# Altium project PCB_Project_1.PrjPcb
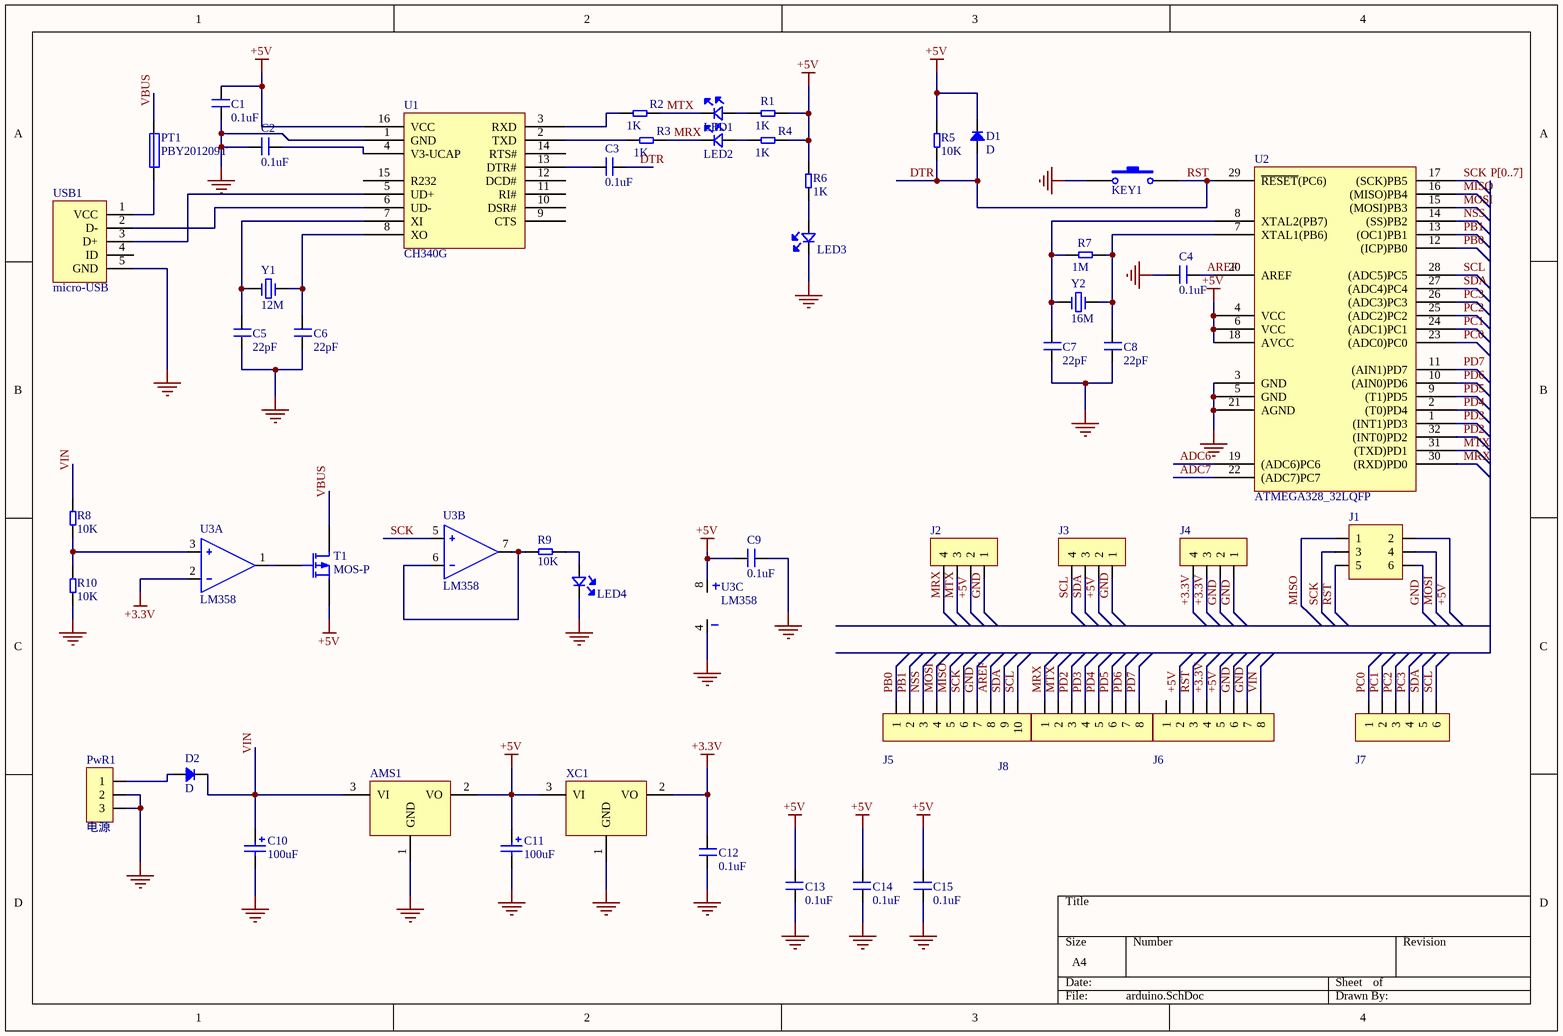
[diagram p0: arduino.SchDoc]
1 sheet, 51 parts. Net scope: global (net labels, ports and power ports of the same name join across sheets).
Board file: arduino.PcbDoc

## Sheet arduino.SchDoc: arduino
size A4; DrawnBy: 陈伟燊

### Parts
AMS1  AMS1117-5.0  [AMS1117-5.0]  (value not drawn)
C1  0.1uF  [0805C]
C2  0.1uF  [0805C]
C3  0.1uF  [0805C]
C4  0.1uF  [0805C]
C5  22pF  [0805C]
C6  22pF  [0805C]
C7  22pF  [0805C]
C8  22pF  [0805C]
C9  0.1uF  [0805C]
C10  100uF  [CAP_P]
C11  100uF  [CAP_P]
C12  0.1uF  [0805C]
C13  0.1uF  [0805C]
C14  0.1uF  [0805C]
C15  0.1uF  [0805C]
D1  D  [1206D]
D2  D  [1206D]
J1  Header 2*3  [PIN2*3]  (value not drawn)
J2  Header  [PIN4]  (value not drawn)
J3  Header  [PIN4]  (value not drawn)
J4  Header  [PIN4]  (value not drawn)
J5  Header 10  [PIN10]  (value not drawn)
J6  Header 8  [PIN8]  (value not drawn)
J7  Header 6  [PIN6]  (value not drawn)
J8  Header 8  [PIN8]  (value not drawn)
KEY1  KEY  [KEY]  (value not drawn)
LED1  LED  [0805L]  (value not drawn)
LED2  LED  [0805L]  (value not drawn)
LED3  LED  [0805L]  (value not drawn)
LED4  LED  [0805L]  (value not drawn)
PT1  PBY201209T  [PT]
PwR1  电源  [DC005]
R1  1K  [0805R]
R2  1K  [0805R]
R3  1K  [0805R]
R4  1K  [0805R]
R5  10K  [0805R]
R6  1K  [0805R]
R7  1M  [0805R]
R8  10K  [0805R]
R9  10K  [0805R]
R10  10K  [0805R]
T1  MOS-P  [SI2301]
U1  CH340G  [CH340G]
U2  ATMEGA328_32LQFP  [ATMEGA328P-AU]
U3  LM358  [LM358]  (parts A,B,C of 3)
USB1  micro-USB  [micro-usb]
XC1  XC6206P332  [XC626P332]  (value not drawn)
Y1  12M  [CRYSTAL]
Y2  16M  [CRYSTAL]

### Nets
+3.3V: C12.1 J4.3 J4.4 J6.4 U3.2 XC1.2(VO)
+5V: AMS1.2(VO) C1.2 C9.1 C11.1 C13.2 C14.2 C15.2 D1.1 J1.2 J2.2 J3.2 J6.2 J6.5 R1.2 R4.2 R5.2 R6.2 T1.2(S) U1.16(VCC) U2.4(VCC) U2.6(VCC) U2.18(AVCC) U3.8 XC1.3(VI)
GND: AMS1.1(GND) C1.1 C2.1 C4.1 C5.2 C6.2 C7.2 C8.2 C9.2 C10.2 C11.2 C12.2 C13.1 C14.1 C15.1 J1.6 J2.1 J3.1 J4.1 J4.2 J5.7 J6.6 J6.7 KEY1.3 LED3.2 LED4.2 PwR1.2 PwR1.3 R10.1 U1.1(GND) U2.3(GND) U2.5(GND) U2.21(AGND) U3.4 USB1.5(GND) XC1.1(GND)
ADC6: U2.19((ADC6)PC6)
ADC7: U2.22((ADC7)PC7)
AREF: C4.2 J5.8 U2.20(AREF)
DTR: C3.2 D1.2 J1.5 J6.3 KEY1.2 R5.1 U2.29(~{RESET}(PC6))  [also labelled RST]
MISO: J1.1 J5.5 U2.16((MISO)PB4)
MOSI: J1.4 J5.4 U2.15((MOSI)PB3)
MRX: J2.4 J8.1 LED2.2 R3.2 U2.30((RXD)PD0)
MTX: J2.3 J8.2 LED1.2 R2.2 U2.31((TXD)PD1)
NSS: J5.3 U2.14((SS)PB2)
PB0: J5.1 U2.12((ICP)PB0)
PB1: J5.2 U2.13((OC1)PB1)
PC0: J7.1 U2.23((ADC0)PC0)
PC1: J7.2 U2.24((ADC1)PC1)
PC2: J7.3 U2.25((ADC2)PC2)
PC3: J7.4 U2.26((ADC3)PC3)
PD2: J8.3 U2.32((INT0)PD2)
PD3: J8.4 U2.1((INT1)PD3)
PD4: J8.5 U2.2((T0)PD4)
PD5: J8.6 U2.9((T1)PD5)
PD6: J8.7 U2.10((AIN0)PD6)
PD7: J8.8 U2.11((AIN1)PD7)
SCK: J1.3 J5.6 U2.17((SCK)PB5) U3.5
SCL: J3.4 J5.10 J7.6 U2.28((ADC5)PC5)
SDA: J3.3 J5.9 J7.5 U2.27((ADC4)PC4)
VBUS: PT1.2 T1.3(D)
VIN: AMS1.3(VI) C10.1 D2.1 J6.8 R8.2
NetC2_2: C2.2 U1.4(V3-UCAP)
NetC3_1: C3.1 U1.13(DTR#)
NetC5_1: C5.1 U1.7(XI) Y1.1
NetC6_1: C6.1 U1.8(XO) Y1.2
NetC7_1: C7.1 R7.1 U2.8(XTAL2(PB7)) Y2.1
NetC8_1: C8.1 R7.2 U2.7(XTAL1(PB6)) Y2.2
NetD2_2: D2.2 PwR1.1
NetLED1_1: LED1.1 R1.1
NetLED2_1: LED2.1 R4.1
NetLED3_1: LED3.1 R6.1
NetLED4_1: LED4.1 R9.1
NetPT1_1: PT1.1 USB1.1(VCC)
NetR2_1: R2.1 U1.3(RXD)
NetR3_1: R3.1 U1.2(TXD)
NetR8_1: R8.1 R10.2 U3.3
NetR9_2: R9.2 U3.6 U3.7
NetT1_1: T1.1(G) U3.1
NetU1_5: U1.5(UD+) USB1.3(D+)
NetU1_6: U1.6(UD-) USB1.2(D-)

Not connected (* = marked no-connect by the designer): J6 1; U1 9(CTS) 10(DSR#) 11(RI#) 12(DCD#) 14(RTS#) 15(R232); USB1 4(ID)

### Buses and harness runs
bus P[0..7]

### Library data of the parts
C1-C9 C12-C15 = CAP
C10 C11 = CAPP
J2-J4 = Header 4
PT1 = PT
PwR1 = PwR
R1-R10 = RES
Y1 Y2 = CRYSTAL